# EAGLE design WSN_Gateway_v4.2 (EAGLE 9.0.1)
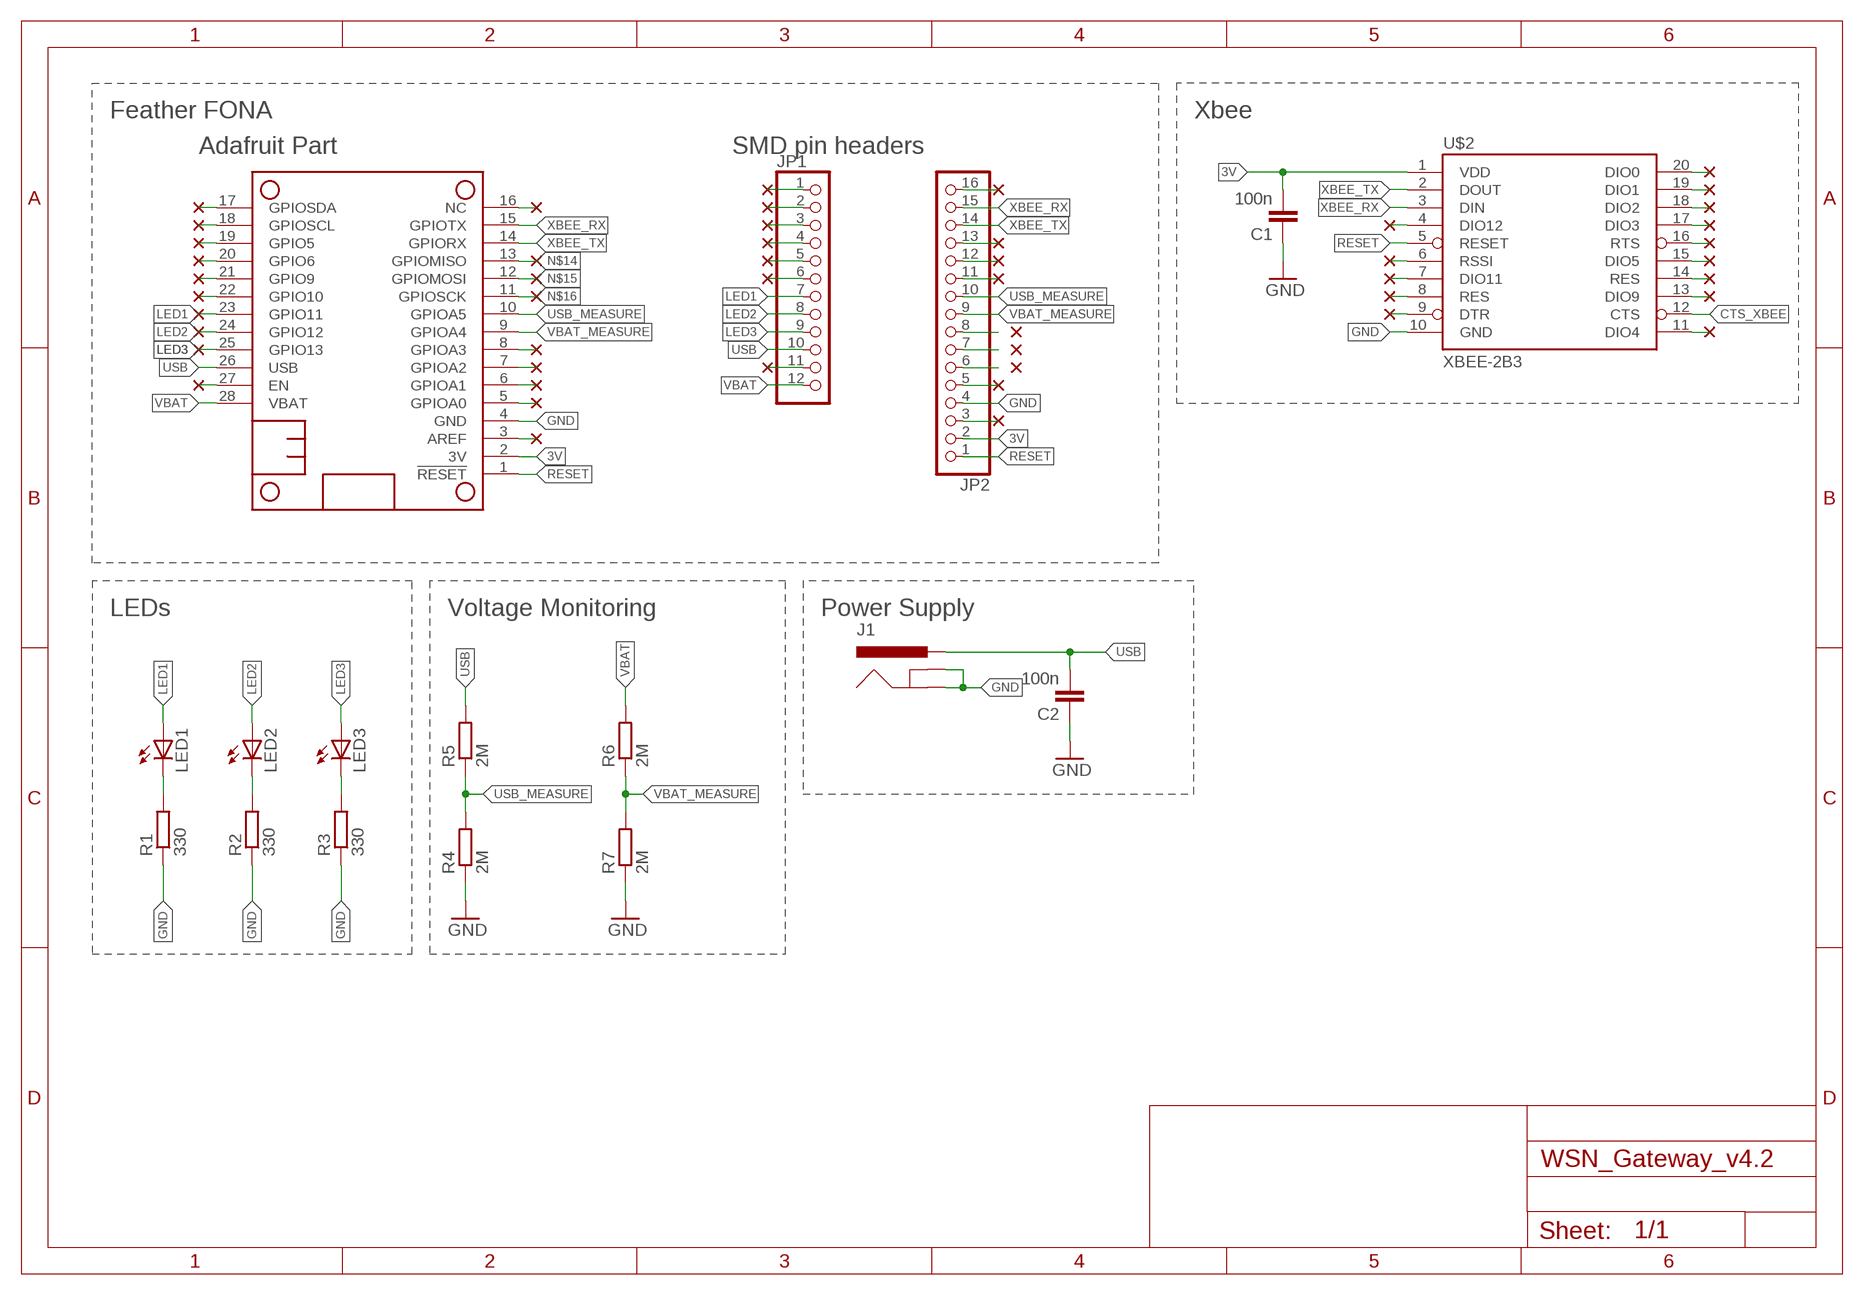
[diagram p0: schematic, sheet 1]

## Parts
C1  100n  C  [C0805]
C2  100n  C  [C0805]
J1  5.5x2.1mm Barrel  POWER_JACKSMD  [POWER_JACK_SMD]
JP1  PINHD-1X121X12_SMT  [1X12_SMT]
JP2  PINHD-1X161X16_SMT  [1X16_SMT]
LED1  LEDCHIPLED_0805  [CHIPLED_0805]
LED2  LEDCHIPLED_0805  [CHIPLED_0805]
LED3  LEDCHIPLED_0805  [CHIPLED_0805]
MS1  FEATHERWING_NODIM_NOHOLES  [FEATHERWING_DIM_2]
R1  330  R-EU_R0805  [R0805]
R2  330  R-EU_R0805  [R0805]
R3  330  R-EU_R0805  [R0805]
R4  2M  R-EU_R0805  [R0805]
R5  2M  R-EU_R0805  [R0805]
R6  2M  R-EU_R0805  [R0805]
R7  2M  R-EU_R0805  [R0805]
U$2  XBEE-2B3  [XBEE-SMD]

## Nets
3V: C1.2 JP2.2 MS1.2(3V) U$2.1(VDD)
CTS_XBEE: U$2.12(CTS)
GND: C1.1 C2.1 J1.GND(GNDBREAK) J1.P$4(GND) JP2.4 MS1.4(GND) R1.1 R2.1 R3.1 R4.1 R7.1 U$2.10(GND)
LED1: JP1.7 LED1.A MS1.23(GPIO11)
LED2: JP1.8 LED2.A MS1.24(GPIO12)
LED3: JP1.9 LED3.A MS1.25(GPIO13)
N$1: LED1.C R1.2
N$2: LED2.C R2.2
N$3: LED3.C R3.2
N$7: MS1.22(GPIO10)
N$8: MS1.21(GPIO9)
N$9: MS1.20(GPIO6)
N$10: MS1.19(GPIO5)
N$11: MS1.18(GPIOSCL)
N$12: MS1.17(GPIOSDA)
N$13: MS1.16(NC)
N$14: MS1.13(GPIOMISO)
N$15: MS1.12(GPIOMOSI)
N$16: MS1.11(GPIOSCK)
N$17: MS1.5(GPIOA0)
N$18: MS1.3(AREF)
N$19: JP1.1
N$20: MS1.27(EN)
N$21: JP1.2
N$22: JP1.3
N$23: JP1.4
N$24: JP1.5
N$25: JP1.6
N$29: U$2.6(RSSI)
N$30: JP1.11
N$31: U$2.4(DIO12)
N$32: JP2.16
N$33: U$2.7(DIO11)
N$34: U$2.8(RES)
N$35: JP2.13
N$36: JP2.12
N$37: JP2.11
N$38: U$2.9(DTR)
N$39: U$2.20(DIO0)
N$40: U$2.19(DIO1)
N$41: U$2.18(DIO2)
N$42: U$2.17(DIO3)
N$43: JP2.5
N$44: U$2.16(RTS)
N$45: JP2.3
N$46: U$2.15(DIO5)
N$47: U$2.14(RES)
N$48: U$2.13(DIO9)
N$49: U$2.11(DIO4)
NC6: JP2.6 MS1.6(GPIOA1)
NC7: JP2.7 MS1.7(GPIOA2)
NC8: JP2.8 MS1.8(GPIOA3)
RESET: JP2.1 MS1.1(!RESET) U$2.5(RESET)
USB: C2.2 J1.VIN0(PWR) J1.VIN1(PWR) JP1.10 MS1.26(USB) R5.2
USB_MEASURE: JP2.10 MS1.10(GPIOA5) R4.2 R5.1
VBAT: JP1.12 MS1.28(VBAT) R6.2
VBAT_MEASURE: JP2.9 MS1.9(GPIOA4) R6.1 R7.2
XBEE_RX: JP2.15 MS1.15(GPIOTX) U$2.3(DIN)
XBEE_TX: JP2.14 MS1.14(GPIORX) U$2.2(DOUT)

## Notes on the sheet
- Feather FONA | Xbee
- Adafruit Part | SMD pin headers
- LEDs | Voltage Monitoring | Power Supply

## Library data of the parts
C1 C2 = wsn:C: CAPACITOR, European symbol; SPICEMODEL: NONE; SPICEPREFIX: C
J1 = wsn:POWER_JACK: Power Jack This is the standard 5.5mm barrel jack for power. The PTH is the most common, proven, reliable, footprint. The Slot footprint only works if the mill layer is transmitted to the PCB fab house so be warned. Mating wall wart : TOL-00298 (and others); PROD_ID: CONN-08106; SF_ID: PRT-12748
JP1 = pinhead+:PINHD-1X12: PIN HEADER
JP2 = pinhead+:PINHD-1X16: PIN HEADER
LED1-LED3 = adafruit:LED: LED OSRAM: - CHIPLED LG R971, LG N971, LY N971, LG Q971, LY Q971, LO R971, LY R971 LH N974, LH R974 LS Q976, LO Q976, LY Q976 LO Q996 - Hyper CHIPLED LW Q18S LB Q993, LB Q99A, LB R99A - SideLED LS A670, LO A670, LY A670, LG A670, LP A670 LB A673, LV A673, LT A673, LW A673 LH A674 LY A675 LS A676, LA A676, LO A676, LY A676, LW A676 LS A679, LY A679, LG A679 - Hyper Micro SIDELED® LS Y876, LA Y876, LO Y876, LY Y876 LT Y87S - SmartLED LW L88C, LW L88S LB L89C, LB L89S, LG L890 LS L89K, LO L89K, LY L89K LS L896, LA L896, LO L896, LY L896 - TOPLED LS T670, LO T670, LY T670, LG T670, LP T670 LSG T670, LSP T670, LSY T670, LOP T670, LYG T670 LG T671, LOG T671, LSG T671 LB T673, LV T673, LT T673, LW T673 LH T674 LS T676, LA T676, LO T676, LY T676, LB T676, LH T676, LSB T676, LW T676 LB T67C, LV T67C, LT T67C, LS T67K, LO T67K, LY T67K, LW E67C LS E67B, LA E67B, LO E67B, LY E67B, LB E67C, LV E67C, LT E67C LW T67C LS T679, LY T679, LG T679 LS T770, LO T770, LY T770, LG T770, LP T770 LB T773, LV T773, LT T773, LW T773 LH T774 LS E675, LA E675, LY E675, LS T675 LS T776, LA T776, LO T776, LY T776, LB T776 LHGB T686 LT T68C, LB T68C - Hyper Mini TOPLED® LB M676 - Mini TOPLED Santana® LG M470 LS M47K, LO M47K, LY M47K Source: http://www.osram.convergy.de/
MS1 = adafruit:FEATHERWING
R1-R7 = rcl:R-EU_: RESISTOR, European symbol
U$2 = SparkFun-RF:XBEE-2: Xbee module footprints SMT header is CONN-09042.; PROD_ID: CONN-09042

## Board
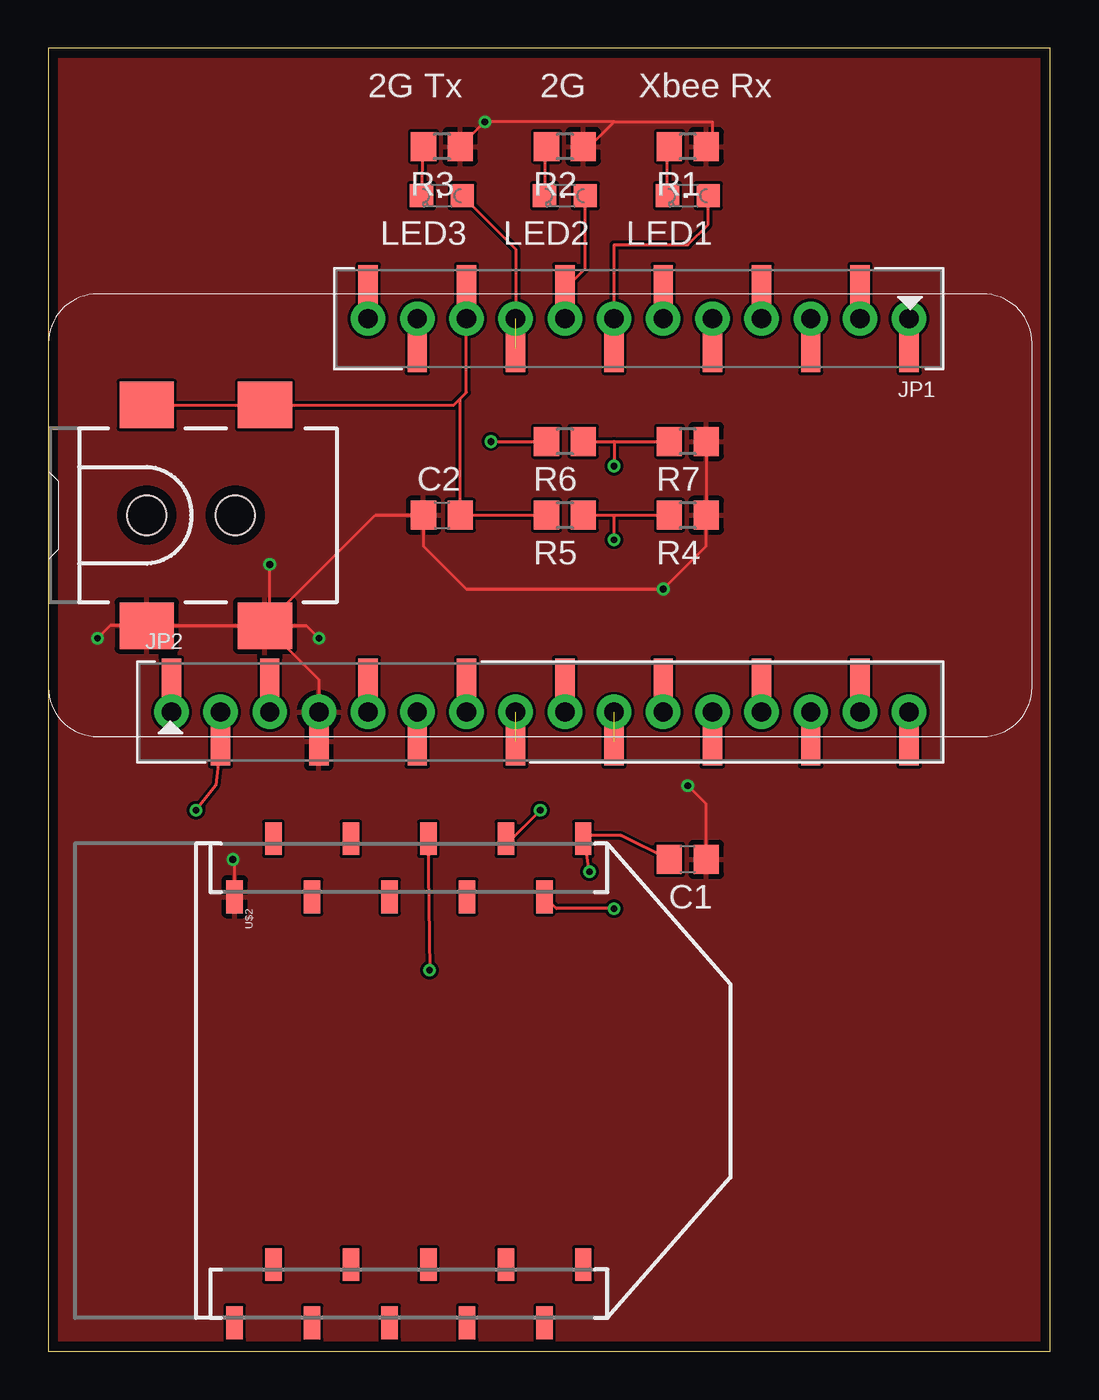
[diagram p1: board, top side]
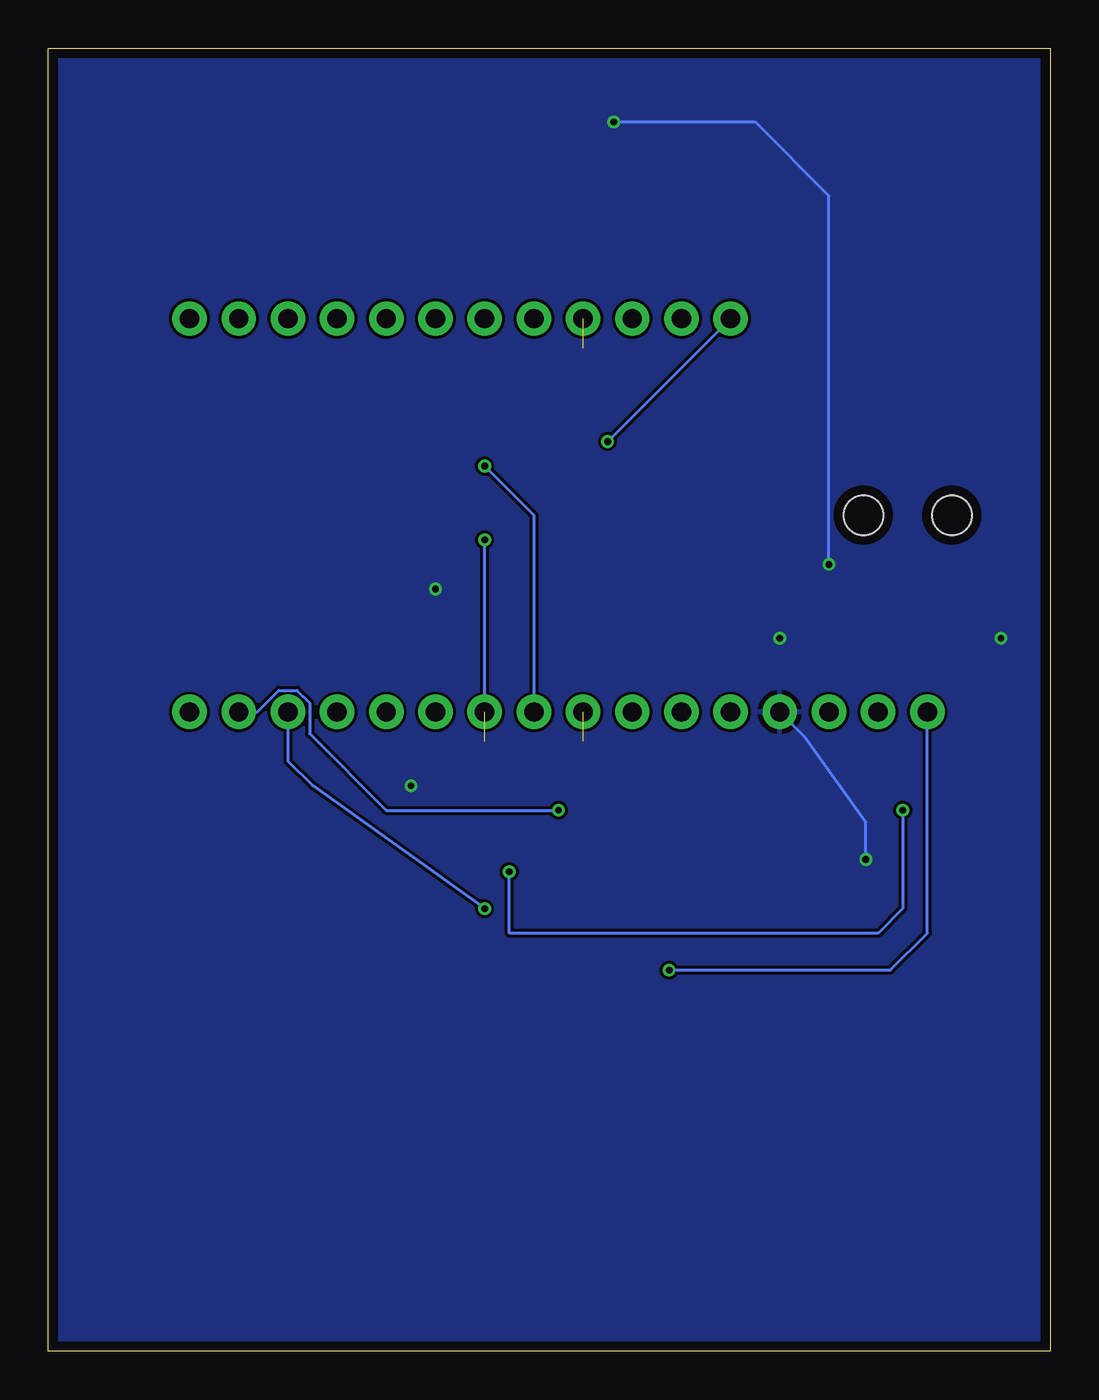
[diagram p2: board, bottom side, seen from below]

Size 51.74 x 67.3 mm. Coordinates in mm from the lower left corner, seen from the top.
Outline: 0,0 51.74,0 51.74,67.3 0,67.3 0,0
Copper layers (1*16): Top 0.035mm / dielectric 1.6mm / Bottom 0.035mm
Design rules "Elecrow_2-layer_PCB_eagle_rule": minimum track width 6mil, minimum drill 12mil, track to track 6mil, track to pad 6mil, pad to pad 6mil, via to via 8mil, smd to smd 0mil, copper to edge 20mil, drill to drill 10mil, minimum pad ring 6mil, minimum via ring 6mil, stop-mask expansion 0mil, vias tented up to drill 100mil, thermal gap 10mil

### Footprints (pad centres in the part's own frame; a part is rotated, then mirrored left to right if it is on the bottom)
C0805 = smd 1.3 x 1.5: 1 -0.95,0; 2 0.95,0
POWER_JACK_SMD = smd 2.8 x 2.4: GND 0,-5.7; P$4 6.1,-5.7; VIN0 0,5.7; VIN1 6.1,5.7 | hole 2.032: 0,0; 4.572,0
1X12_SMT = smd 1 x 2.5: 1 -13.97,1.52; 2 -11.43,-1.52; 3 -8.89,1.52; 4 -6.35,-1.52; 5 -3.81,1.52; 6 -1.27,-1.52; 7 1.27,1.52; 8 3.81,-1.52; 9 6.35,1.52; 10 8.89,-1.52; 11 11.43,1.52; 12 13.97,-1.52
1X16_SMT = smd 1 x 2.5: 1 -19.05,1.52; 2 -16.51,-1.52; 3 -13.97,1.52; 4 -11.43,-1.52; 5 -8.89,1.52; 6 -6.35,-1.52; 7 -3.81,1.52; 8 -1.27,-1.52; 9 1.27,1.52; 10 3.81,-1.52; 11 6.35,1.52; 12 8.89,-1.52; 13 11.43,1.52; 14 13.97,-1.52; 15 16.51,1.52; 16 19.05,-1.52
CHIPLED_0805 = smd 1.2 x 1.2: A 0,-1.05; C 0,1.05
FEATHERWING_DIM_2 = drill 1 pad 1.778: 1 6.35,1.27; 2 8.89,1.27; 3 11.43,1.27; 4 13.97,1.27; 5 16.51,1.27; 6 19.05,1.27; 7 21.59,1.27; 8 24.13,1.27; 9 26.67,1.27; 10 29.21,1.27; 11 31.75,1.27; 12 34.29,1.27; 13 36.83,1.27; 14 39.37,1.27; 15 41.91,1.27; 16 44.45,1.27; 17 44.45,21.59; 18 41.91,21.59; 19 39.37,21.59; 20 36.83,21.59; 21 34.29,21.59; 22 31.75,21.59; 23 29.21,21.59; 24 26.67,21.59; 25 24.13,21.59; 26 21.59,21.59; 27 19.05,21.59; 28 16.51,21.59
R0805 = smd 1.3 x 1.5: 1 -0.95,0; 2 0.95,0
XBEE-SMD = smd 1.7 x 0.85: 1 -12.5,20; 2 -9.5,18; 3 -12.5,16; 4 -9.5,14; 5 -12.5,12; 6 -9.5,10; 7 -12.5,8; 8 -9.5,6; 9 -12.5,4; 10 -9.5,2; 11 12.5,2; 12 9.5,4; 13 12.5,6; 14 9.5,8; 15 12.5,10; 16 9.5,12; 17 12.5,14; 18 9.5,16; 19 12.5,18; 20 9.5,20

### Placement (x,y rotation side)
C1  33.02,25.4 180 top
C2  20.32,43.18 0 top
J1  5.08,43.18 0 top
JP1  30.48,53.34 180 top
JP2  25.4,33.02 0 top
LED1  33.02,59.69 90 top
LED2  26.67,59.69 90 top
LED3  20.32,59.69 90 top
MS1  0,31.75 0 top
R1  33.02,62.23 180 top
R2  26.67,62.23 180 top
R3  20.32,62.23 180 top
R4  33.02,43.18 180 top
R5  26.67,43.18 180 top
R6  26.67,46.99 180 top
R7  33.02,46.99 180 top
U$2  7.62,13.97 270 top

### Tracks (layer width: path | path; a pad name or v marks a point on that pad's centre or on a via)
3V  (via drill 0.35)
  Top 0.152: MS1.2 JP2.2 8.64,29.21 v7.62,27.94 | v27.94,24.77 27.67,26.63 | 27.67,26.63 27.62,26.99 U$2.1 | C1.2 29.57,26.63 27.67,26.63
  Bottom 0.152: v7.62,27.94 7.62,22.86 8.89,21.59 27.94,21.59 v27.94,24.77
GND  (via drill 0.35)
  Top 0.152: JP2.4 MS1.4 13.97,34.69 J1.P$4 | J1.P$4 J1.GND 3.19,37.48 v2.54,36.83 | U$2.10 9.62,25.4 v9.53,25.4 | J1.P$4 16.88,43.18 C2.1 19.37,41.59 21.59,39.37 v31.75,39.37 33.97,41.59 R4.1 R7.1 | C1.1 33.97,28.26 v33.02,29.21 | R3.1 v22.54,63.5 29.21,63.5 | 34.29,62.23 34.29,63.5 29.21,63.5 | R2.1 27.94,62.23 29.21,63.5 | J1.P$4 11.43,37.73 v11.43,40.64 | J1.P$4 13.32,37.48 v13.97,36.83
  Bottom 0.152: v9.53,25.4 9.53,27.3 12.7,31.75 MS1.4 | v22.54,63.5 15.24,63.5 11.43,59.69 v11.43,40.64
  pour Bottom: -2.54,71.12 54.61,71.12 54.61,-2.54 -2.54,-2.54
  pour Top: -1.27,69.85 53.34,69.85 53.34,-1.27 -1.27,-1.27
LED1
  Top 0.152: JP1.7 MS1.23 29.21,57.15 33.02,57.15 34.07,58.2 LED1.A
LED2
  Top 0.152: MS1.24 JP1.8 27.72,55.91 LED2.A
LED3  (1 unrouted)
  Top 0.152: LED3.A 24.13,56.93 MS1.25
N$1
  Top 0.152: LED1.C 31.97,62.13 R1.2
N$2
  Top 0.152: R2.2 arc90 25.62,62.13 LED2.C
N$3
  Top 0.152: LED3.C R3.2
NC6
  Top 0.152: MS1.6 JP2.6
NC7
  Top 0.152: JP2.7 MS1.7
NC8  (1 unrouted)
RESET  (via drill 0.35)
  Top 0.152: JP2.1 MS1.1 | U$2.5 19.62,24.77 v19.68,19.68
  Bottom 0.152: v19.68,19.68 8.26,19.68 6.35,21.59 MS1.1
USB
  Top 0.152: J1.VIN0 J1.VIN1 20.94,48.88 21.27,49.21 | JP1.10 MS1.26 21.59,49.53 21.27,49.21 | 21.27,49.21 C2.2 R5.2
USB_MEASURE  (via drill 0.35)  (1 unrouted)
  Top 0.152: R5.1 29.21,43.18 | 29.21,43.18 R4.2 | v29.21,41.91 29.21,43.18
  Bottom 0.152: MS1.10 v29.21,41.91
VBAT  (via drill 0.35)
  Top 0.152: JP1.12 MS1.28 | v22.86,46.99 R6.2
  Bottom 0.152: MS1.28 v22.86,46.99
VBAT_MEASURE  (via drill 0.35)
  Top 0.152: MS1.9 JP2.9 | R6.1 29.21,46.99 | 29.21,46.99 R7.2 | 29.21,46.99 v29.21,45.72
  Bottom 0.152: v29.21,45.72 26.67,43.18 MS1.9
XBEE_RX  (via drill 0.35)
  Top 0.152: JP2.15 MS1.15 | v25.4,27.94 23.93,26.47 U$2.3
  Bottom 0.152: MS1.15 40.95,33.02 39.83,34.14 38.91,34.14 38.25,33.48 38.25,31.9 34.29,27.94 v25.4,27.94
XBEE_TX  (via drill 0.35)
  Top 0.152: JP2.14 MS1.14 | v29.21,22.86 26.23,22.86 U$2.2
  Bottom 0.152: MS1.14 39.37,30.48 38.1,29.21 v29.21,22.86

### Text on the board
tPlace: 2G Tx | 2G | Xbee Rx